# EasyEDA schematic 3S 10A BMS.json

## Sheets
1 3s 10A Schematic
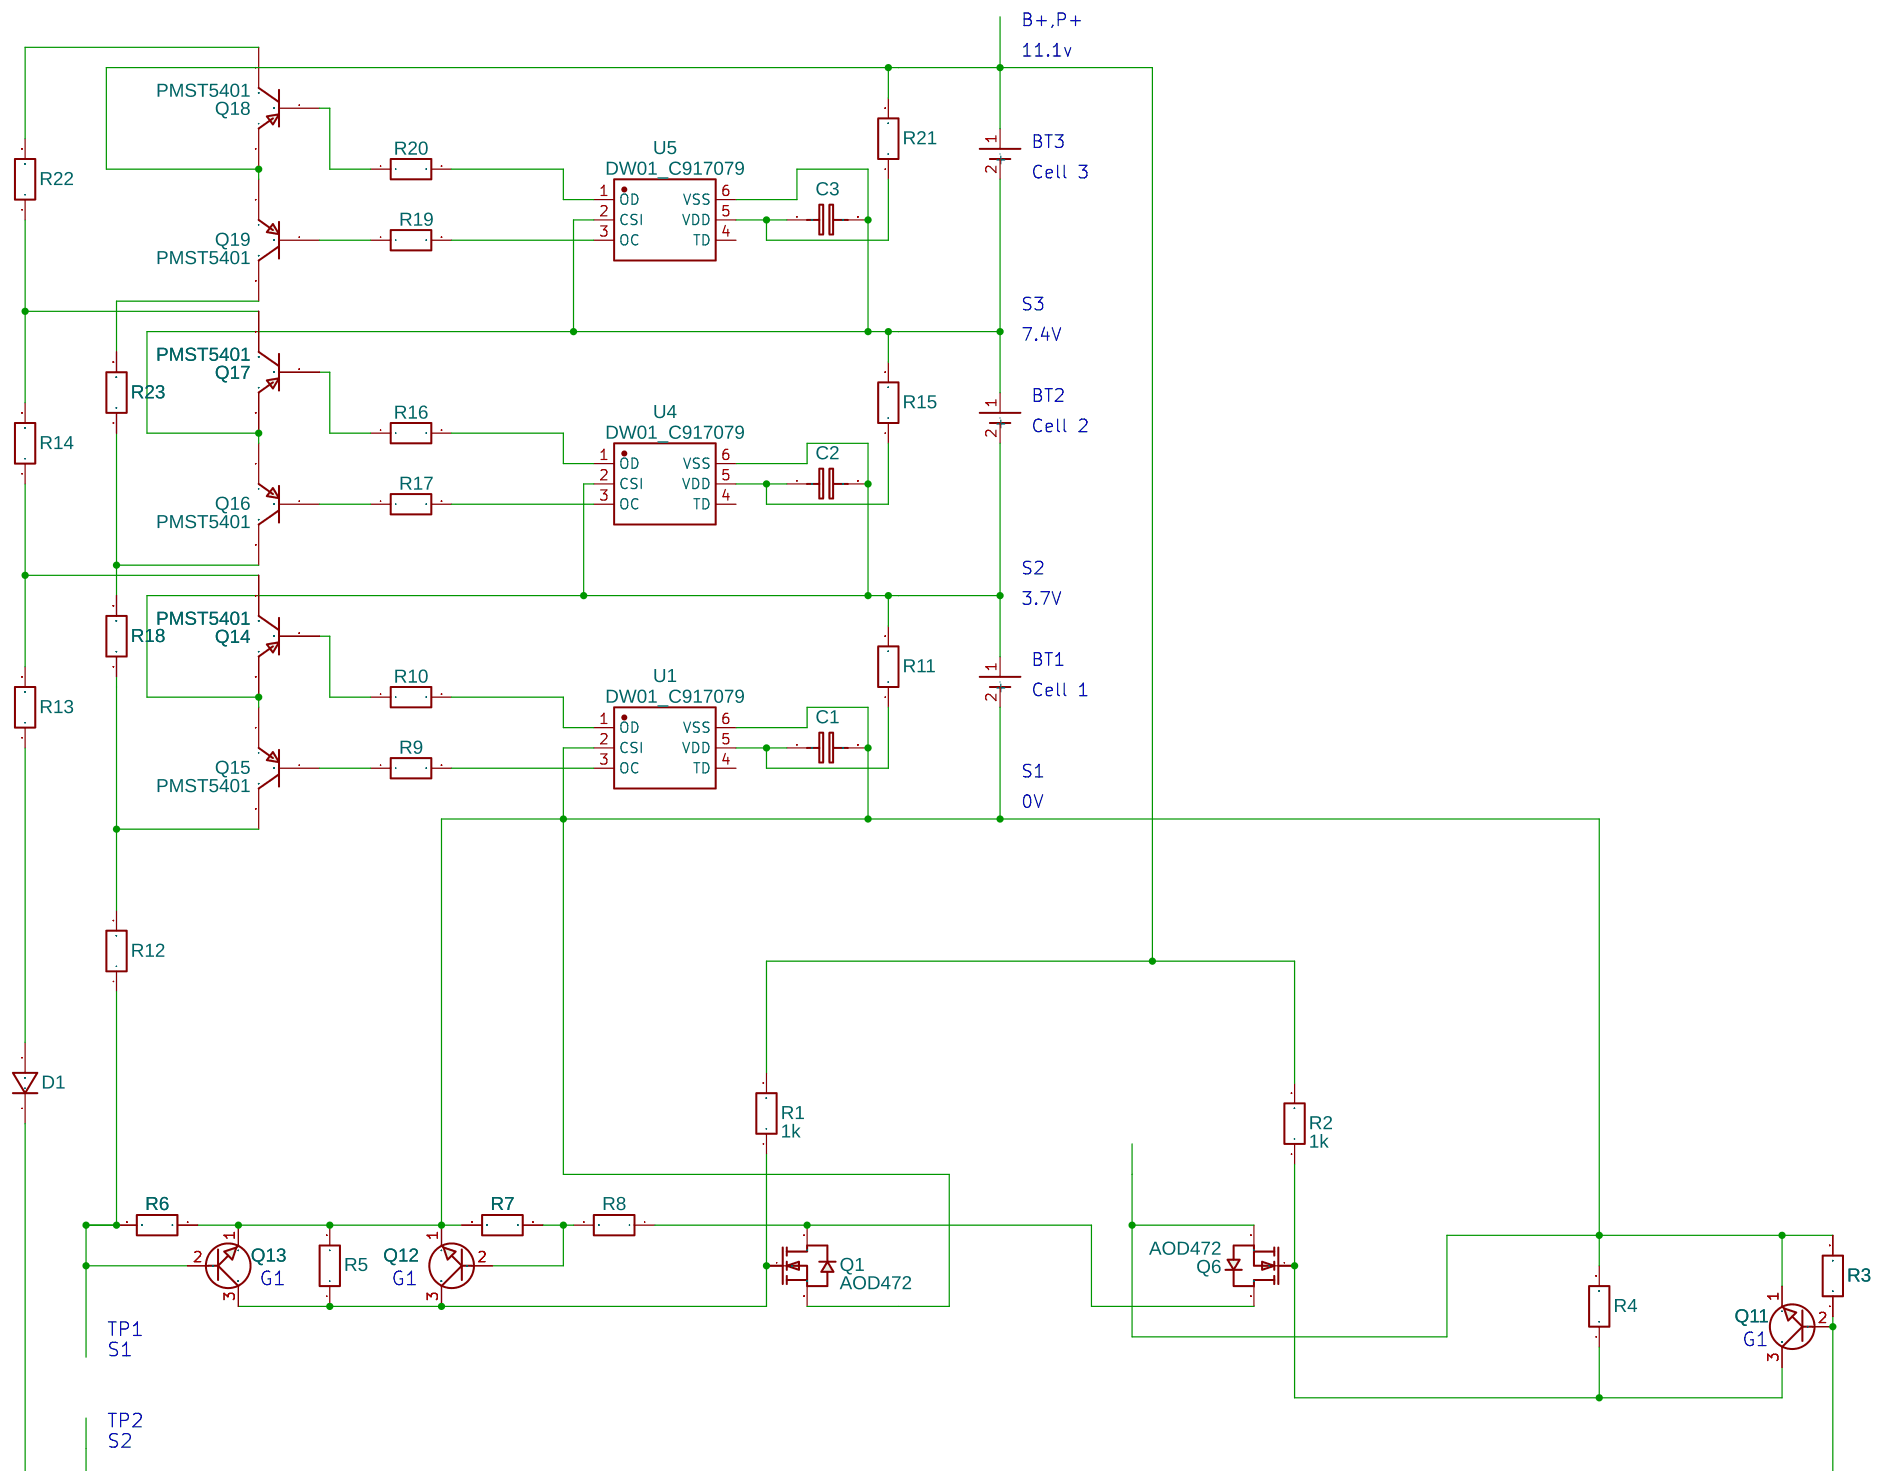
[diagram p0: 3s 10A Schematic]
2 12v connection
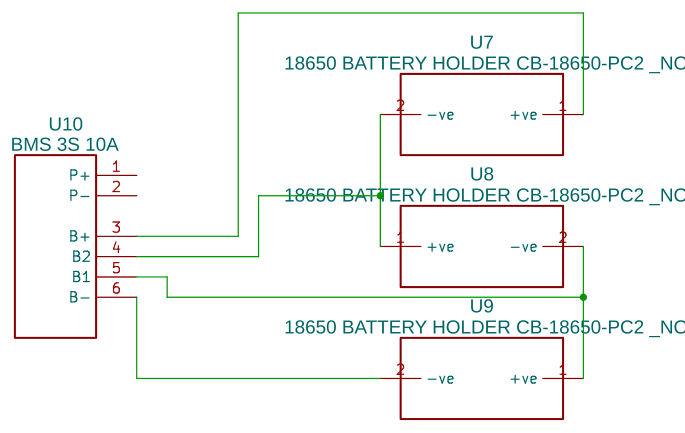
[diagram p1: 12v connection]

## Parts
sheet 3s 10A Schematic
C1  0.1u  [C0603]
C2  0.1u  [C0603]
C3  0.1u  [C0603]
D1  1N4007W  [SOD-123_L2.8-W1.8-LS3.7-RD]
Q1  AOD472  [TO-252-2_L6.6-W6.1-P4.57-LS9.9-BR-CW]
Q6  AOD472  [TO-252-2_L6.6-W6.1-P4.57-LS9.9-BR-CW]
Q11  2N2222  [NPN]
Q12  2N2222  [NPN]
Q13  2N2222  [NPN]
Q14  PMST5401  [SOT323]
Q15  PMST5401  [SOT323]
Q16  PMST5401  [SOT323]
Q17  PMST5401  [SOT323]
Q18  PMST5401  [SOT323]
Q19  PMST5401  [SOT323]
R1  1k  [R0603]
R2  1k  [R0603]
R3  1k  [R0603]
R4  1k  [R0603]
R5  1k  [R0603]
R6  1k  [R0603]
R7  1k  [R0603]
R8  1k  [R0603]
R9  1k  [R0603]
R10  1k  [R0603]
R11  1k  [R0603]
R12  1k  [R0603]
R13  1k  [R0603]
R14  1k  [R0603]
R15  1k  [R0603]
R16  1k  [R0603]
R17  1k  [R0603]
R18  1k  [R0603]
R19  1k  [R0603]
R20  1k  [R0603]
R21  1k  [R0603]
R22  1k  [R0603]
R23  1k  [R0603]
U1  DW01_C917079  [SOT-23-6_L2.9-W1.6-P0.95-LS2.8-BL]
U2  Li-ion battery  [LI-ION BATTERY]
U3  Li-ion battery  [LI-ION BATTERY]
U4  DW01_C917079  [SOT-23-6_L2.9-W1.6-P0.95-LS2.8-BL]
U5  DW01_C917079  [SOT-23-6_L2.9-W1.6-P0.95-LS2.8-BL]
U6  Li-ion battery  [LI-ION BATTERY]
sheet 12v connection
U7  18650 BATTERY HOLDER CB-18650-PC2 _NOTEMP COPY  [18650 BATTERY HOLDER CB-18650-PC2]
U8  18650 BATTERY HOLDER CB-18650-PC2 _NOTEMP COPY  [18650 BATTERY HOLDER CB-18650-PC2]
U9  18650 BATTERY HOLDER CB-18650-PC2 _NOTEMP COPY  [18650 BATTERY HOLDER CB-18650-PC2]
U10  BMS 3S 10A  [BMS 3S 10A]

## Library data of the parts
C1-C3 = C_0603_EU: Contributor: LCEDA_Lib
D1 = 1N4007W: Supplier: LCSC; Supplier Part: C328592; Manufacturer: BLUE ROCKET; Contributor: LCEDA_Lib
Q1 Q6 = AOD472: Supplier: LCSC; Supplier Part: C693172; Manufacturer: VBsemi Elec; Contributor: LCSC; JLCPCB Part Class: Extended Part
Q11-Q13 = 2N2222: Contributor: KiCad
Q14-Q19 = PMST5401: PNP High-voltage Transistor
R1-R23 = R_0603_EU: Contributor: LCEDA_Lib
U1 U4 U5 = DW01_C917079: Supplier: LCSC; Supplier Part: C917079; Manufacturer: JSMSEMI(杰盛微); Manufacturer Part: DW01; Contributor: LCSC; JLCPCB Part Class: Extended Part
U2 U3 U6 = Li-ion battery: Contributor: Mega Videolar (H. Selim Serdar)
U7-U9 = 18650 BATTERY HOLDER CB-18650-PC2 _NOTEMP COPY: Contributor: recfvpernz
U10 = BMS 3S 10A: Contributor: annuarzainiabdullah68

## Nets
Net-(C1-1): C1.1 R11.1 U1.5(VDD)
Net-(C1-2): C1.2 Q1.3(S) Q6.3(S) Q11.1(E) Q12.1(E) Q13.1(E) R3.2 R4.2 R5.2 R6.1 R7.2 U1.2(CSI) U1.6(VSS) U2.2(-)
Net-(C2-1): C2.1 R15.1 U4.5(VDD)
Net-(C2-2): C2.2 Q14.2(E) Q15.2(E) R11.2 U2.1(+) U3.2(-) U4.2(CSI) U4.6(VSS)
Net-(C3-1): C3.1 R21.1 U5.5(VDD)
Net-(C3-2): C3.2 Q16.2(E) Q17.2(E) R15.2 U3.1(+) U5.2(CSI) U5.6(VSS) U6.2(-)
Net-(D1-1): D1.1 Q11.2(B) R3.1
Net-(D1-2): D1.2 R13.1
Net-(Q1-1): Q1.1(G) Q12.3(C) Q13.3(C) R1.1 R5.1
Net-(Q1-2): Q1.2(D) Q6.2(D) R8.1
Net-(Q6-1): Q6.1(G) Q11.3(C) R2.1 R4.1
Net-(Q12-2): Q12.2(B) R7.1 R8.2
Net-(Q13-2): Q13.2(B) R6.2 R12.1
Net-(Q14-1): Q14.1(B) R10.1
Net-(Q14-3): Q14.3(C) R13.2 R14.1
Net-(Q15-1): Q15.1(B) R9.1
Net-(Q15-3): Q15.3(C) R12.2 R18.1
Net-(Q16-1): Q16.1(B) R17.1
Net-(Q16-3): Q16.3(C) R18.2 R23.1
Net-(Q17-1): Q17.1(B) R16.1
Net-(Q17-3): Q17.3(C) R14.2 R22.1
Net-(Q18-1): Q18.1(B) R20.1
Net-(Q18-2): Q18.2(E) Q19.2(E) R1.2 R2.2 R21.2 U6.1(+)
Net-(Q18-3): Q18.3(C) R22.2
Net-(Q19-1): Q19.1(B) R19.1
Net-(Q19-3): Q19.3(C) R23.2
Net-(R9-2): R9.2 U1.3(OC)
Net-(R10-2): R10.2 U1.1(OD)
Net-(R16-2): R16.2 U4.1(OD)
Net-(R17-2): R17.2 U4.3(OC)
Net-(R19-2): R19.2 U5.3(OC)
Net-(R20-2): R20.2 U5.1(OD)
Net-(U7-1): U7.1(+ve) U10.3(B+)
Net-(U7-2): U7.2(-ve) U8.1(+ve) U10.4(B2)
Net-(U8-2): U8.2(-ve) U9.1(+ve) U10.5(B1)
Net-(U9-2): U9.2(-ve) U10.6(B-)

Not connected (* = marked no-connect by the designer): U1 4(TD); U4 4(TD); U5 4(TD); U10 1(P+) 2(P-)

## Notes on the sheets
sheet 1
- B+,P+
- 11.1v
- BT3
- Cell 3
- S3
- 7.4V
- BT2
- Cell 2
- S2
- 3.7V
- BT1
- Cell 1
- S1
- 0V
- G1
- G1
- S1
- TP1
- G1
- TP2
- S2
